# EAGLE board newPins-primitive (EAGLE 9.6.2), part 1 of 2
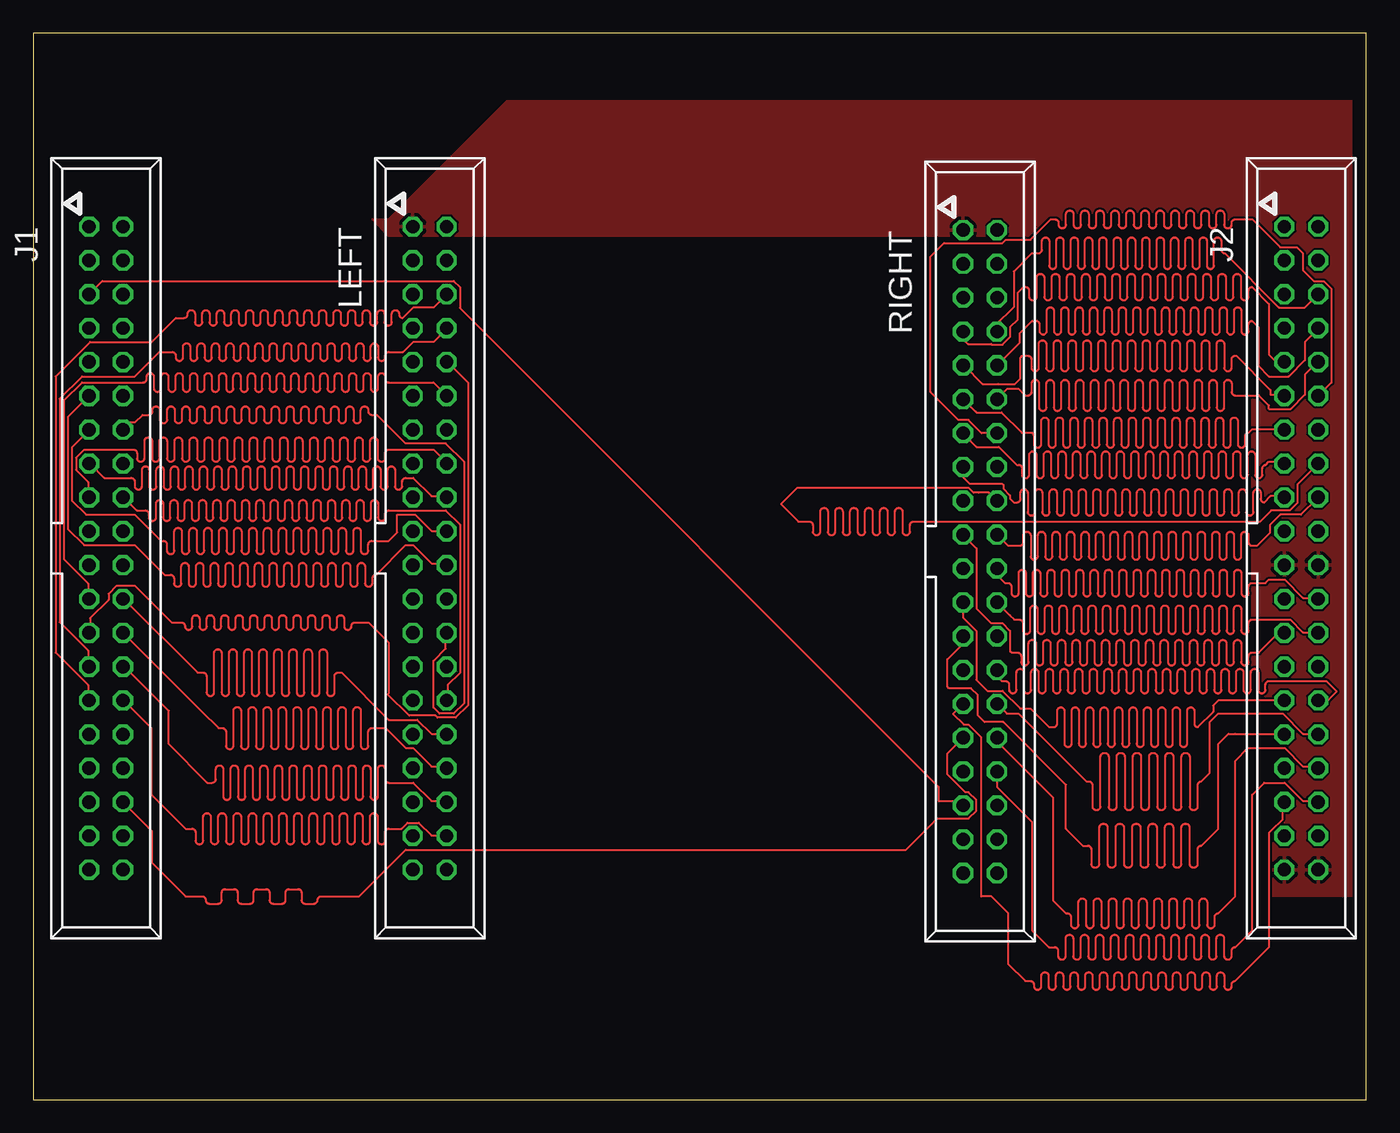
[diagram p1: board, top side]
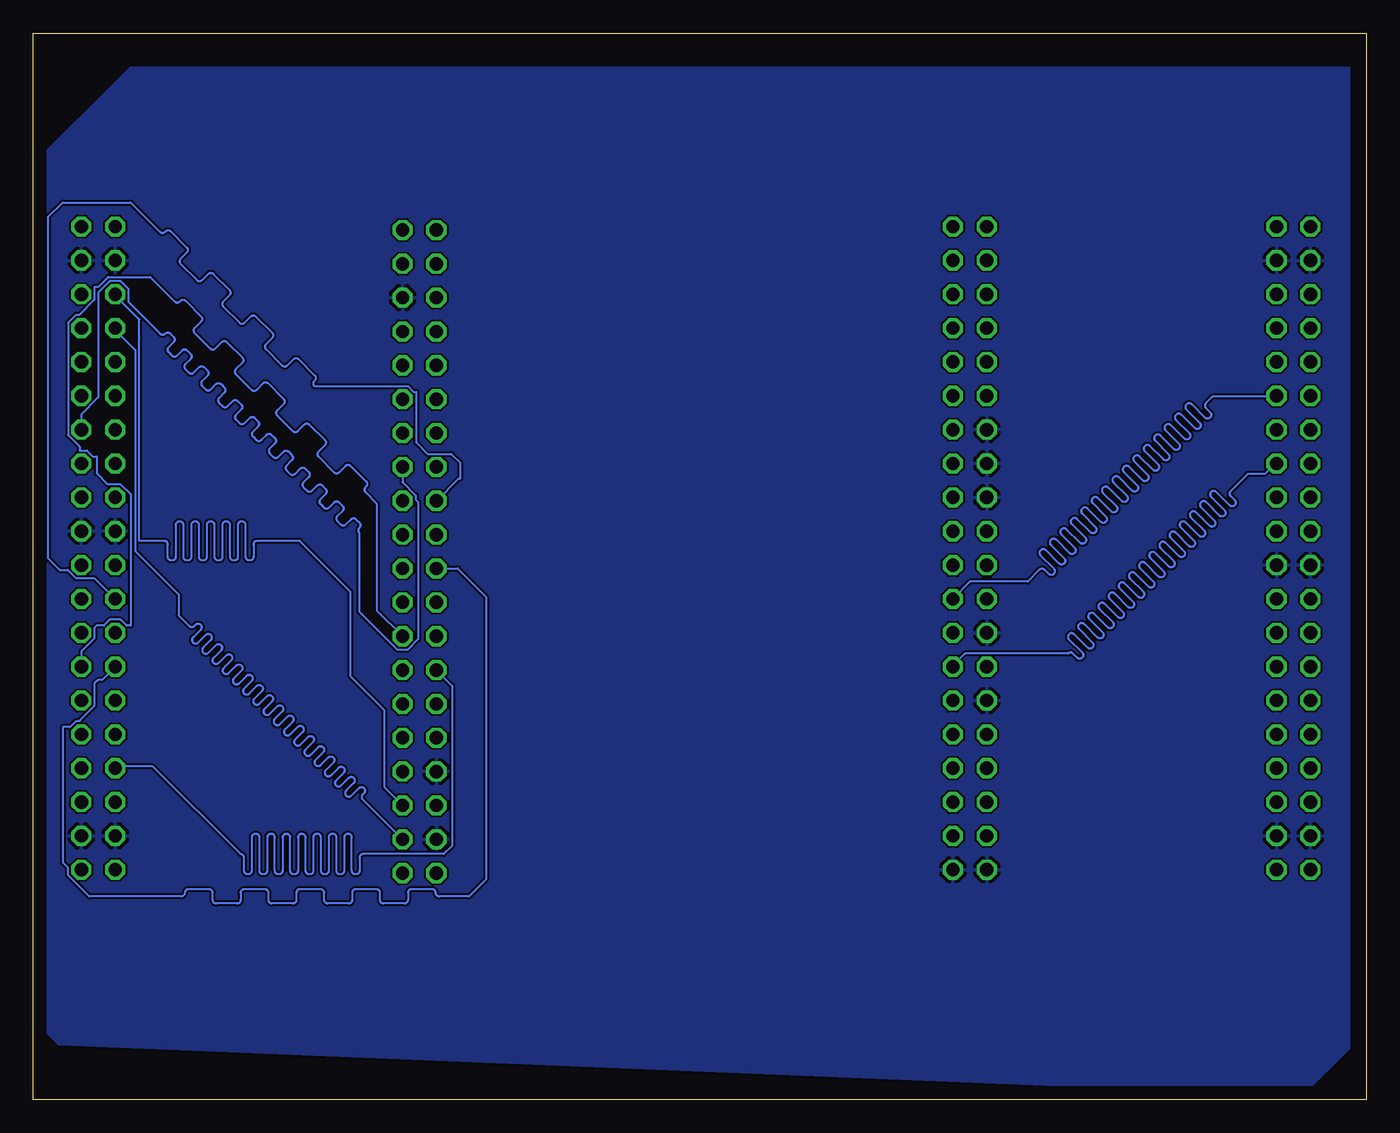
[diagram p2: board, bottom side, seen from below]

Size 100 x 80 mm. Coordinates in mm from the lower left corner, seen from the top.
Outline: 0,0 100,0 100,80 0,80 0,0
Copper layers (1*16): Top 0.035mm / dielectric 1.5mm / Bottom 0.035mm
Design rules "default *": minimum track width 6mil, minimum drill 0.35mm, track to track 6mil, track to pad 6mil, pad to pad 6mil, via to via 6mil, smd to smd 6mil, copper to edge 40mil, drill to drill 6mil, minimum pad ring 10mil, minimum via ring 8mil, stop-mask expansion 4mil, vias tented up to drill 0mil, thermal gap 10mil

## Footprints (pad centres in the part's own frame; a part is rotated, then mirrored left to right if it is on the bottom)
057-040-1 = drill 1 octagon: 1 -24.13,-1.27; 2 -24.13,1.27; 3 -21.59,-1.27; 4 -21.59,1.27; 5 -19.05,-1.27; 6 -19.05,1.27; 7 -16.51,-1.27; 8 -16.51,1.27; 9 -13.97,-1.27; 10 -13.97,1.27; 11 -11.43,-1.27; 12 -11.43,1.27; 13 -8.89,-1.27; 14 -8.89,1.27; 15 -6.35,-1.27; 16 -6.35,1.27; 17 -3.81,-1.27; 18 -3.81,1.27; 19 -1.27,-1.27; 20 -1.27,1.27; 21 1.27,-1.27; 22 1.27,1.27; 23 3.81,-1.27; 24 3.81,1.27; 25 6.35,-1.27; 26 6.35,1.27; 27 8.89,-1.27; 28 8.89,1.27; 29 11.43,-1.27; 30 11.43,1.27; 31 13.97,-1.27; 32 13.97,1.27; 33 16.51,-1.27; 34 16.51,1.27; 35 19.05,-1.27; 36 19.05,1.27; 37 21.59,-1.27; 38 21.59,1.27; 39 24.13,-1.27; 40 24.13,1.27

## Placement (x,y rotation side)
J1  057-040-1  [057-040-1]  5.45,41.37 270 top
J2  057-040-1  [057-040-1]  95.13,41.37 270 top
LEFT  057-040-1  [057-040-1]  29.74,41.37 270 top
RIGHT  057-040-1  [057-040-1]  71.03,41.12 270 top

## Tracks (layer width: path | path; a pad name or v marks a point on that pad's centre or on a via)
+3V3
  pour Top: 26.67,66.04 35.56,74.93 100.33,74.93 100.33,15.24 91.44,15.24 91.44,62.23 88.9,64.77 26.67,64.77 25.4,66.04
CTL_0
  Top 0.152: J1.36 8.81,20.24 8.89,20.15 8.89,17.78 11.43,15.24 12.67,15.24 arc-90 12.93,14.97 12.93,14.96 arc90 13.2,14.69 13.87,14.69 arc90 14.13,14.96 14.13,15.52 arc-90 14.4,15.79 15.06,15.79 arc-90 15.33,15.52 15.33,14.96 arc90 15.6,14.69 16.26,14.69 arc90 16.53,14.96 16.53,15.52 arc-90 16.8,15.79 17.46,15.79 arc-90 17.73,15.52 17.73,14.96 arc90 18,14.69 18.66,14.69 arc90 18.93,14.96 18.93,15.52 arc-90 19.19,15.79 19.86,15.79 arc-90 20.12,15.52 20.12,14.96 arc90 20.39,14.69 21.06,14.69 arc90 21.32,14.96 21.32,14.97 arc-90 21.59,15.24 24.43,15.24 27.94,18.75 65.48,18.75 67.82,21.08 70.17,21.08 70.74,21.66 70.74,22.47 70.17,23.05 69.93,23.05 68.58,24.39 68.58,25.96 RIGHT.31
CTL_1
  Top 0.152: J2.35 93.73,22.4 93.73,21.04 92.88,20.19 92.71,20.02 92.71,11.43 90.17,8.89 arc90 89.9,8.62 89.9,8.5 arc-90 89.64,8.23 89.62,8.23 arc-90 89.35,8.5 89.35,9.28 arc90 89.09,9.54 89.07,9.54 arc90 88.81,9.28 88.81,8.5 arc-90 88.54,8.23 88.52,8.23 arc-90 88.25,8.5 88.25,9.28 arc90 87.99,9.54 87.97,9.54 arc90 87.71,9.28 87.71,8.5 arc-90 87.44,8.23 87.42,8.23 arc-90 87.16,8.5 87.16,9.28 arc90 86.89,9.54 86.87,9.54 arc90 86.61,9.28 86.61,8.5 arc-90 86.34,8.23 86.33,8.23 arc-90 86.06,8.5 86.06,9.28 arc90 85.79,9.54 85.78,9.54 arc90 85.51,9.28 85.51,8.5 arc-90 85.24,8.23 85.23,8.23 arc-90 84.96,8.5 84.96,9.28 arc90 84.69,9.54 84.68,9.54 arc90 84.41,9.28 84.41,8.5 arc-90 84.14,8.23 84.13,8.23 arc-90 83.86,8.5 83.86,9.28 arc90 83.59,9.54 83.58,9.54 arc90 83.31,9.28 83.31,8.5 arc-90 83.05,8.23 83.03,8.23 arc-90 82.76,8.5 82.76,9.28 arc90 82.5,9.54 82.48,9.54 arc90 82.21,9.28 82.21,8.5 arc-90 81.95,8.23 81.93,8.23 arc-90 81.66,8.5 81.66,9.28 arc90 81.4,9.54 81.38,9.54 arc90 81.11,9.28 81.11,8.5 arc-90 80.85,8.23 80.83,8.23 arc-90 80.56,8.5 80.56,9.28 arc90 80.3,9.54 80.28,9.54 arc90 80.02,9.28 80.02,8.5 arc-90 79.75,8.23 79.73,8.23 arc-90 79.47,8.5 79.47,9.28 arc90 79.2,9.54 79.18,9.54 arc90 78.92,9.28 78.92,8.5 arc-90 78.65,8.23 78.64,8.23 arc-90 78.37,8.5 78.37,9.28 arc90 78.1,9.54 78.09,9.54 arc90 77.82,9.28 77.82,8.5 arc-90 77.55,8.23 77.54,8.23 arc-90 77.27,8.5 77.27,9.28 arc90 77,9.54 76.99,9.54 arc90 76.72,9.28 76.72,8.5 arc-90 76.45,8.23 76.44,8.23 arc-90 76.17,8.5 76.17,9.28 arc90 75.9,9.54 75.89,9.54 arc90 75.62,9.28 75.62,8.5 arc-90 75.36,8.23 75.34,8.23 arc-90 75.07,8.5 75.07,8.62 arc90 74.81,8.89 74.42,8.89 73.15,10.16 73.15,13.97 71.88,15.24 71.12,15.24 71.12,27.18 70.17,28.13 69.81,28.13 69.01,28.93 RIGHT.29
CTL_2
  Bottom 0.152: J2.33 93.73,24.99 91.03,24.99 84.45,18.41 arc90 84.19,18.15 84.19,17.16 arc-90 83.92,16.9 83.88,16.9 arc-90 83.61,17.16 83.61,19.66 arc90 83.34,19.93 83.3,19.93 arc90 83.03,19.66 83.03,17.16 arc-90 82.77,16.9 82.72,16.9 arc-90 82.45,17.16 82.45,19.66 arc90 82.19,19.93 82.14,19.93 arc90 81.88,19.66 81.88,17.16 arc-90 81.61,16.9 81.57,16.9 arc-90 81.3,17.16 81.3,19.66 arc90 81.03,19.93 80.99,19.93 arc90 80.72,19.66 80.72,17.16 arc-90 80.46,16.9 80.41,16.9 arc-90 80.14,17.16 80.14,19.66 arc90 79.88,19.93 79.83,19.93 arc90 79.57,19.66 79.57,17.16 arc-90 79.3,16.9 79.26,16.9 arc-90 78.99,17.16 78.99,19.66 arc90 78.72,19.93 78.68,19.93 arc90 78.41,19.66 78.41,17.16 arc-90 78.14,16.9 78.1,16.9 arc-90 77.83,17.16 77.83,19.66 arc90 77.57,19.93 77.52,19.93 arc90 77.26,19.66 77.26,17.16 arc-90 76.99,16.9 76.95,16.9 arc-90 76.68,17.16 76.68,19.66 arc90 76.41,19.93 76.37,19.93 arc90 76.1,19.66 76.1,17.16 arc-90 75.83,16.9 75.79,16.9 arc-90 75.52,17.16 75.52,18.15 arc90 75.26,18.41 69.22,18.41 68.58,19.05 68.58,31.05 RIGHT.27
CTL_3
  Top 0.152: J2.31 93.73,27.43 90.17,27.43 89.66,27.43 88.9,26.67 88.9,20.32 87.63,19.05 arc90 87.36,18.78 87.36,17.68 arc-90 87.1,17.41 87.02,17.41 arc-90 86.75,17.68 86.75,20.42 arc90 86.48,20.69 86.4,20.69 arc90 86.13,20.42 86.13,17.68 arc-90 85.87,17.41 85.78,17.41 arc-90 85.52,17.68 85.52,20.42 arc90 85.25,20.69 85.17,20.69 arc90 84.9,20.42 84.9,17.68 arc-90 84.64,17.41 84.56,17.41 arc-90 84.29,17.68 84.29,20.42 arc90 84.02,20.69 83.94,20.69 arc90 83.67,20.42 83.67,17.68 arc-90 83.41,17.41 83.32,17.41 arc-90 83.06,17.68 83.06,20.42 arc90 82.79,20.69 82.71,20.69 arc90 82.44,20.42 82.44,17.68 arc-90 82.18,17.41 82.09,17.41 arc-90 81.83,17.68 81.83,20.42 arc90 81.56,20.69 81.48,20.69 arc90 81.21,20.42 81.21,17.68 arc-90 80.95,17.41 80.86,17.41 arc-90 80.6,17.68 80.6,20.42 arc90 80.33,20.69 80.25,20.69 arc90 79.98,20.42 79.98,17.68 arc-90 79.72,17.41 79.63,17.41 arc-90 79.37,17.68 79.37,18.78 arc90 79.1,19.05 78.74,19.05 77.47,20.32 77.47,23.62 72.77,28.32 71.37,28.32 70.87,28.83 70.87,30.35 70.36,30.86 68.71,30.86 68.58,30.99 68.58,33.02 69.76,34.2 RIGHT.25
CTL_4
  Top 0.152: J2.29 88.9,29.94 88.52,29.56 88.52,29.08 87.38,27.94 arc-90 87.11,28.21 87.11,29.16 arc90 86.84,29.43 86.83,29.43 arc90 86.57,29.16 86.57,26.72 arc-90 86.3,26.45 86.29,26.45 arc-90 86.03,26.72 86.03,29.16 arc90 85.76,29.43 85.75,29.43 arc90 85.48,29.16 85.48,26.72 arc-90 85.22,26.45 85.21,26.45 arc-90 84.94,26.72 84.94,29.16 arc90 84.68,29.43 84.67,29.43 arc90 84.4,29.16 84.4,26.72 arc-90 84.13,26.45 84.13,26.45 arc-90 83.86,26.72 83.86,29.16 arc90 83.59,29.43 83.58,29.43 arc90 83.32,29.16 83.32,26.72 arc-90 83.05,26.45 83.04,26.45 arc-90 82.78,26.72 82.78,29.16 arc90 82.51,29.43 82.5,29.43 arc90 82.23,29.16 82.23,26.72 arc-90 81.97,26.45 81.96,26.45 arc-90 81.69,26.72 81.69,29.16 arc90 81.43,29.43 81.42,29.43 arc90 81.15,29.16 81.15,26.72 arc-90 80.88,26.45 80.88,26.45 arc-90 80.61,26.72 80.61,29.16 arc90 80.34,29.43 80.33,29.43 arc90 80.07,29.16 80.07,26.72 arc-90 79.8,26.45 79.79,26.45 arc-90 79.53,26.72 79.53,29.16 arc90 79.26,29.43 79.25,29.43 arc90 78.98,29.16 78.98,26.72 arc-90 78.72,26.45 78.71,26.45 arc-90 78.44,26.72 78.44,29.16 arc90 78.18,29.43 78.17,29.43 arc90 77.9,29.16 77.9,26.72 arc-90 77.64,26.45 77.63,26.45 arc-90 77.36,26.72 77.36,29.16 arc90 77.09,29.43 77.08,29.43 arc90 76.82,29.16 76.82,28.21 arc-90 76.55,27.94 76.2,27.94 74.8,29.34 74.04,29.34 72.71,30.67 71.57,30.67 70.74,31.49 70.74,35.17 69.76,36.16 RIGHT.23
CTL_5
  Bottom 0.152: J2.27 94.84,31.5 95.12,31.5 95.42,31.2 95.42,29.53 96.52,28.43 96.52,28.38 96.81,28.38 97.25,27.94 97.79,27.94 97.79,17.78 97.38,17.37 97.38,16.83 95.79,15.24 88.9,15.24 arc-90 88.63,15.51 88.63,15.51 arc90 88.37,15.78 86.81,15.78 arc90 86.54,15.51 86.54,14.97 arc-90 86.28,14.7 84.72,14.7 arc-90 84.45,14.97 84.45,15.51 arc90 84.18,15.78 82.62,15.78 arc90 82.36,15.51 82.36,14.97 arc-90 82.09,14.7 80.53,14.7 arc-90 80.27,14.97 80.27,15.51 arc90 80,15.78 78.44,15.78 arc90 78.17,15.51 78.17,14.97 arc-90 77.91,14.7 76.35,14.7 arc-90 76.08,14.97 76.08,15.51 arc90 75.81,15.78 74.26,15.78 arc90 73.99,15.51 73.99,14.97 arc-90 73.72,14.7 72.16,14.7 arc-90 71.9,14.97 71.9,15.51 arc90 71.63,15.78 70.07,15.78 arc90 69.81,15.51 69.81,15.51 arc-90 69.54,15.24 67.31,15.24 66.04,16.51 66.04,37.72 68.17,39.84 RIGHT.21
CTL_6
  Top 0.152: J2.25 93.52,35.1 91.95,33.53 91.44,33.53 arc90 91.17,33.26 91.17,32.84 arc-90 90.91,32.57 90.89,32.57 arc-90 90.62,32.84 90.62,34.22 arc90 90.36,34.48 90.34,34.48 arc90 90.07,34.22 90.07,32.84 arc-90 89.81,32.57 89.79,32.57 arc-90 89.52,32.84 89.52,34.22 arc90 89.26,34.48 89.24,34.48 arc90 88.97,34.22 88.97,32.84 arc-90 88.71,32.57 88.69,32.57 arc-90 88.42,32.84 88.42,34.22 arc90 88.16,34.48 88.14,34.48 arc90 87.87,34.22 87.87,32.84 arc-90 87.61,32.57 87.59,32.57 arc-90 87.32,32.84 87.32,34.22 arc90 87.06,34.48 87.04,34.48 arc90 86.77,34.22 86.77,32.84 arc-90 86.5,32.57 86.49,32.57 arc-90 86.22,32.84 86.22,34.22 arc90 85.95,34.48 85.94,34.48 arc90 85.67,34.22 85.67,32.84 arc-90 85.4,32.57 85.39,32.57 arc-90 85.12,32.84 85.12,34.22 arc90 84.85,34.48 84.84,34.48 arc90 84.57,34.22 84.57,32.84 arc-90 84.3,32.57 84.29,32.57 arc-90 84.02,32.84 84.02,34.22 arc90 83.75,34.48 83.74,34.48 arc90 83.47,34.22 83.47,32.84 arc-90 83.2,32.57 83.19,32.57 arc-90 82.92,32.84 82.92,34.22 arc90 82.65,34.48 82.64,34.48 arc90 82.37,34.22 82.37,32.84 arc-90 82.1,32.57 82.09,32.57 arc-90 81.82,32.84 81.82,34.22 arc90 81.55,34.48 81.54,34.48 arc90 81.27,34.22 81.27,32.84 arc-90 81,32.57 80.99,32.57 arc-90 80.72,32.84 80.72,34.22 arc90 80.45,34.48 80.44,34.48 arc90 80.17,34.22 80.17,32.84 arc-90 79.9,32.57 79.89,32.57 arc-90 79.62,32.84 79.62,34.22 arc90 79.35,34.48 79.33,34.48 arc90 79.07,34.22 79.07,32.84 arc-90 78.8,32.57 78.78,32.57 arc-90 78.52,32.84 78.52,34.22 arc90 78.25,34.48 78.23,34.48 arc90 77.97,34.22 77.97,32.84 arc-90 77.7,32.57 77.68,32.57 arc-90 77.42,32.84 77.42,34.22 arc90 77.15,34.48 77.13,34.48 arc90 76.87,34.22 76.87,32.84 arc-90 76.6,32.57 76.58,32.57 arc-90 76.32,32.84 76.32,34.22 arc90 76.05,34.48 76.03,34.48 arc90 75.77,34.22 75.77,32.84 arc-90 75.5,32.57 75.48,32.57 arc-90 75.22,32.84 75.22,34.22 arc90 74.95,34.48 74.93,34.48 arc90 74.67,34.22 74.67,32.84 arc-90 74.4,32.57 74.38,32.57 arc-90 74.12,32.84 74.12,33.26 arc90 73.85,33.53 73.41,33.53 73.28,33.65 73.28,35.17 72.71,35.75 71.85,35.75 70.76,36.83 70.76,41.35 69.85,42.27 69.85,42.3 RIGHT.19
CTL_7
  Bottom 0.152: J2.23 95.42,39.12 96.81,39.12 97.38,39.69 97.42,39.73 98,39.73 98.91,40.64 98.91,66.19 97.79,67.31 92.71,67.31 90.5,65.1 arc-90 90.12,65.1 90.08,65.14 arc90 89.7,65.14 88.48,63.92 arc90 88.48,63.55 88.95,63.08 arc-90 88.95,62.7 87.72,61.48 arc-90 87.35,61.48 86.88,61.95 arc90 86.5,61.95 85.28,60.73 arc90 85.28,60.35 85.75,59.88 arc-90 85.75,59.5 84.53,58.28 arc-90 84.15,58.28 83.68,58.75 arc90 83.3,58.75 82.08,57.53 arc90 82.08,57.15 82.55,56.68 arc-90 82.55,56.3 81.33,55.08 arc-90 80.95,55.08 80.48,55.55 arc90 80.1,55.55 78.88,54.33 arc90 78.88,53.95 78.93,53.91 arc-90 78.93,53.53 71.89,53.53 71.45,53.09 71.25,53.09 71.25,49.28 70.42,48.45 68.64,48.45 67.94,47.75 67.94,46.61 68.08,46.61 RIGHT.17
CTL_8
  Top 0.152: J2.17 93.73,45.26 92.81,45.26 92.35,44.81 arc-90 92.09,45.07 92.09,45.53 arc90 91.82,45.79 91.81,45.79 arc90 91.54,45.53 91.54,44.09 arc-90 91.28,43.82 91.26,43.82 arc-90 91,44.09 91,45.53 arc90 90.73,45.79 90.72,45.79 arc90 90.45,45.53 90.45,44.09 arc-90 90.18,43.82 90.17,43.82 arc-90 89.9,44.09 89.9,45.53 arc90 89.64,45.79 89.62,45.79 arc90 89.36,45.53 89.36,44.09 arc-90 89.09,43.82 89.08,43.82 arc-90 88.81,44.09 88.81,45.53 arc90 88.54,45.79 88.53,45.79 arc90 88.26,45.53 88.26,44.09 arc-90 88,43.82 87.98,43.82 arc-90 87.72,44.09 87.72,45.53 arc90 87.45,45.79 87.44,45.79 arc90 87.17,45.53 87.17,44.09 arc-90 86.91,43.82 86.89,43.82 arc-90 86.62,44.09 86.62,45.53 arc90 86.36,45.79 86.35,45.79 arc90 86.08,45.53 86.08,44.09 arc-90 85.81,43.82 85.8,43.82 arc-90 85.53,44.09 85.53,45.53 arc90 85.27,45.79 85.25,45.79 arc90 84.99,45.53 84.99,44.09 arc-90 84.72,43.82 84.71,43.82 arc-90 84.44,44.09 84.44,45.53 arc90 84.17,45.79 84.16,45.79 arc90 83.89,45.53 83.89,44.09 arc-90 83.63,43.82 83.61,43.82 arc-90 83.35,44.09 83.35,45.53 arc90 83.08,45.79 83.07,45.79 arc90 82.8,45.53 82.8,44.09 arc-90 82.53,43.82 82.52,43.82 arc-90 82.25,44.09 82.25,45.53 arc90 81.99,45.79 81.98,45.79 arc90 81.71,45.53 81.71,44.09 arc-90 81.44,43.82 81.43,43.82 arc-90 81.16,44.09 81.16,45.53 arc90 80.9,45.79 80.88,45.79 arc90 80.62,45.53 80.62,44.09 arc-90 80.35,43.82 80.34,43.82 arc-90 80.07,44.09 80.07,45.53 arc90 79.8,45.79 79.79,45.79 arc90 79.52,45.53 79.52,44.09 arc-90 79.26,43.82 79.25,43.82 arc-90 78.98,44.09 78.98,45.53 arc90 78.71,45.79 78.7,45.79 arc90 78.43,45.53 78.43,44.09 arc-90 78.17,43.82 78.15,43.82 arc-90 77.89,44.09 77.89,45.53 arc90 77.62,45.79 77.61,45.79 arc90 77.34,45.53 77.34,44.09 arc-90 77.07,43.82 77.06,43.82 arc-90 76.79,44.09 76.79,45.53 arc90 76.53,45.79 76.51,45.79 arc90 76.25,45.53 76.25,44.09 arc-90 75.98,43.82 75.97,43.82 arc-90 75.7,44.09 75.7,45.53 arc90 75.43,45.79 75.42,45.79 arc90 75.15,45.53 75.15,44.09 arc-90 74.89,43.82 74.88,43.82 arc-90 74.61,44.09 74.61,45.53 arc90 74.34,45.79 74.33,45.79 arc90 74.06,45.53 74.06,45.07 arc-90 73.8,44.81 73.56,44.81 73.28,45.08 73.28,45.33 72.78,45.83 72.78,46.12 72.69,46.22 70.25,46.22 69.38,47.09 RIGHT.15
CTL_9
  Top 0.152: J2.15 93.73,47.85 92.71,47.85 92.48,47.62 arc90 92.22,47.36 92.22,46.89 arc-90 91.95,46.62 91.94,46.62 arc-90 91.67,46.89 91.67,48.36 arc90 91.4,48.63 91.39,48.63 arc90 91.12,48.36 91.12,46.89 arc-90 90.86,46.62 90.84,46.62 arc-90 90.58,46.89 90.58,48.36 arc90 90.31,48.63 90.3,48.63 arc90 90.03,48.36 90.03,46.89 arc-90 89.76,46.62 89.75,46.62 arc-90 89.48,46.89 89.48,48.36 arc90 89.22,48.63 89.2,48.63 arc90 88.94,48.36 88.94,46.89 arc-90 88.67,46.62 88.66,46.62 arc-90 88.39,46.89 88.39,48.36 arc90 88.12,48.63 88.11,48.63 arc90 87.84,48.36 87.84,46.89 arc-90 87.57,46.62 87.56,46.62 arc-90 87.29,46.89 87.29,48.36 arc90 87.03,48.63 87.01,48.63 arc90 86.75,48.36 86.75,46.89 arc-90 86.48,46.62 86.47,46.62 arc-90 86.2,46.89 86.2,48.36 arc90 85.93,48.63 85.92,48.63 arc90 85.65,48.36 85.65,46.89 arc-90 85.39,46.62 85.37,46.62 arc-90 85.11,46.89 85.11,48.36 arc90 84.84,48.63 84.83,48.63 arc90 84.56,48.36 84.56,46.89 arc-90 84.29,46.62 84.28,46.62 arc-90 84.01,46.89 84.01,48.36 arc90 83.75,48.63 83.73,48.63 arc90 83.47,48.36 83.47,46.89 arc-90 83.2,46.62 83.19,46.62 arc-90 82.92,46.89 82.92,48.36 arc90 82.65,48.63 82.64,48.63 arc90 82.37,48.36 82.37,46.89 arc-90 82.11,46.62 82.09,46.62 arc-90 81.83,46.89 81.83,48.36 arc90 81.56,48.63 81.55,48.63 arc90 81.28,48.36 81.28,46.89 arc-90 81.01,46.62 81,46.62 arc-90 80.73,46.89 80.73,48.36 arc90 80.47,48.63 80.45,48.63 arc90 80.19,48.36 80.19,46.89 arc-90 79.92,46.62 79.91,46.62 arc-90 79.64,46.89 79.64,48.36 arc90 79.37,48.63 79.36,48.63 arc90 79.09,48.36 79.09,46.89 arc-90 78.83,46.62 78.81,46.62 arc-90 78.55,46.89 78.55,48.36 arc90 78.28,48.63 78.27,48.63 arc90 78,48.36 78,46.89 arc-90 77.73,46.62 77.72,46.62 arc-90 77.45,46.89 77.45,48.36 arc90 77.19,48.63 77.17,48.63 arc90 76.91,48.36 76.91,46.89 arc-90 76.64,46.62 76.63,46.62 arc-90 76.36,46.89 76.36,48.36 arc90 76.09,48.63 76.08,48.63 arc90 75.81,48.36 75.81,46.89 arc-90 75.55,46.62 75.53,46.62 arc-90 75.27,46.89 75.27,48.36 arc90 75,48.63 74.99,48.63 arc90 74.72,48.36 74.72,46.89 arc-90 74.45,46.62 74.44,46.62 arc-90 74.17,46.89 74.17,47.36 arc90 73.91,47.62 73.79,47.62 72.44,48.97 70.76,48.97 69.86,49.89 69.75,50 RIGHT.13
CTL_10
  Top 0.152: J2.13 93.73,50.29 91.44,50.29 91.19,50.04 arc90 90.92,49.77 90.92,49.18 arc-90 90.65,48.91 90.64,48.91 arc-90 90.37,49.18 90.37,50.9 arc90 90.11,51.17 90.09,51.17 arc90 89.83,50.9 89.83,49.18 arc-90 89.56,48.91 89.55,48.91 arc-90 89.28,49.18 89.28,50.9 arc90 89.01,51.17 89,51.17 arc90 88.73,50.9 88.73,49.18 arc-90 88.47,48.91 88.45,48.91 arc-90 88.19,49.18 88.19,50.9 arc90 87.92,51.17 87.91,51.17 arc90 87.64,50.9 87.64,49.18 arc-90 87.37,48.91 87.36,48.91 arc-90 87.09,49.18 87.09,50.9 arc90 86.83,51.17 86.81,51.17 arc90 86.55,50.9 86.55,49.18 arc-90 86.28,48.91 86.27,48.91 arc-90 86,49.18 86,50.9 arc90 85.73,51.17 85.72,51.17 arc90 85.45,50.9 85.45,49.18 arc-90 85.19,48.91 85.17,48.91 arc-90 84.91,49.18 84.91,50.9 arc90 84.64,51.17 84.63,51.17 arc90 84.36,50.9 84.36,49.18 arc-90 84.1,48.91 84.08,48.91 arc-90 83.82,49.18 83.82,50.9 arc90 83.55,51.17 83.54,51.17 arc90 83.27,50.9 83.27,49.18 arc-90 83,48.91 82.99,48.91 arc-90 82.72,49.18 82.72,50.9 arc90 82.46,51.17 82.44,51.17 arc90 82.18,50.9 82.18,49.18 arc-90 81.91,48.91 81.9,48.91 arc-90 81.63,49.18 81.63,50.9 arc90 81.36,51.17 81.35,51.17 arc90 81.08,50.9 81.08,49.18 arc-90 80.82,48.91 80.8,48.91 arc-90 80.54,49.18 80.54,50.9 arc90 80.27,51.17 80.26,51.17 arc90 79.99,50.9 79.99,49.18 arc-90 79.72,48.91 79.71,48.91 arc-90 79.44,49.18 79.44,50.9 arc90 79.18,51.17 79.17,51.17 arc90 78.9,50.9 78.9,49.18 arc-90 78.63,48.91 78.62,48.91 arc-90 78.35,49.18 78.35,50.9 arc90 78.08,51.17 78.07,51.17 arc90 77.81,50.9 77.81,49.18 arc-90 77.54,48.91 77.53,48.91 arc-90 77.26,49.18 77.26,50.9 arc90 76.99,51.17 76.98,51.17 arc90 76.71,50.9 76.71,49.18 arc-90 76.45,48.91 76.43,48.91 arc-90 76.17,49.18 76.17,50.9 arc90 75.9,51.17 75.89,51.17 arc90 75.62,50.9 75.62,49.18 arc-90 75.35,48.91 75.34,48.91 arc-90 75.07,49.18 75.07,49.77 arc90 74.81,50.04 74.17,50.04 72.64,51.56 70.76,51.56 70.69,51.63 69.84,52.47 69.77,52.55 RIGHT.11
CTL_11
  Top 0.152: J2.11 93.73,52.88 92.81,52.88 92.81,53.24 90.25,55.8 90.17,55.8 arc90 89.9,55.54 89.9,54.92 arc-90 89.64,54.65 89.61,54.65 arc-90 89.35,54.92 89.35,56.69 arc90 89.08,56.96 89.06,56.96 arc90 88.79,56.69 88.79,54.92 arc-90 88.52,54.65 88.5,54.65 arc-90 88.23,54.92 88.23,56.69 arc90 87.97,56.96 87.94,56.96 arc90 87.68,56.69 87.68,54.92 arc-90 87.41,54.65 87.39,54.65 arc-90 87.12,54.92 87.12,56.69 arc90 86.86,56.96 86.83,56.96 arc90 86.56,56.69 86.56,54.92 arc-90 86.3,54.65 86.28,54.65 arc-90 86.01,54.92 86.01,56.69 arc90 85.74,56.96 85.72,56.96 arc90 85.45,56.69 85.45,54.92 arc-90 85.19,54.65 85.16,54.65 arc-90 84.9,54.92 84.9,56.69 arc90 84.63,56.96 84.61,56.96 arc90 84.34,56.69 84.34,54.92 arc-90 84.07,54.65 84.05,54.65 arc-90 83.78,54.92 83.78,56.69 arc90 83.52,56.96 83.49,56.96 arc90 83.23,56.69 83.23,54.92 arc-90 82.96,54.65 82.94,54.65 arc-90 82.67,54.92 82.67,56.69 arc90 82.4,56.96 82.38,56.96 arc90 82.11,56.69 82.11,54.92 arc-90 81.85,54.65 81.83,54.65 arc-90 81.56,54.92 81.56,56.69 arc90 81.29,56.96 81.27,56.96 arc90 81,56.69 81,54.92 arc-90 80.73,54.65 80.71,54.65 arc-90 80.44,54.92 80.44,56.69 arc90 80.18,56.96 80.16,56.96 arc90 79.89,56.69 79.89,54.92 arc-90 79.62,54.65 79.6,54.65 arc-90 79.33,54.92 79.33,56.69 arc90 79.07,56.96 79.04,56.96 arc90 78.78,56.69 78.78,54.92 arc-90 78.51,54.65 78.49,54.65 arc-90 78.22,54.92 78.22,56.69 arc90 77.95,56.96 77.93,56.96 arc90 77.66,56.69 77.66,54.92 arc-90 77.4,54.65 77.37,54.65 arc-90 77.11,54.92 77.11,56.69 arc90 76.84,56.96 76.82,56.96 arc90 76.55,56.69 76.55,54.92 arc-90 76.28,54.65 76.26,54.65 arc-90 76,54.92 76,56.69 arc90 75.73,56.96 75.7,56.96 arc90 75.44,56.69 75.44,54.92 arc-90 75.17,54.65 75.15,54.65 arc-90 74.88,54.92 74.88,55.54 arc90 74.61,55.8 74.22,55.8 74.04,55.63 74.04,54.08 73.66,53.7 72.39,53.7 71.22,53.7 69.85,55.08 69.76,55.08 RIGHT.9
CTL_12
  Top 0.152: J2.9 93.73,55.47 93.12,55.47 92.71,55.88 92.71,59.69 91.44,60.96 arc90 91.17,60.69 91.17,60.24 arc-90 90.91,59.98 90.87,59.98 arc-90 90.61,60.24 90.61,61.68 arc90 90.34,61.94 90.31,61.94 arc90 90.04,61.68 90.04,60.24 arc-90 89.77,59.98 89.74,59.98 arc-90 89.47,60.24 89.47,61.68 arc90 89.2,61.94 89.17,61.94 arc90 88.9,61.68 88.9,60.24 arc-90 88.64,59.98 88.6,59.98 arc-90 88.33,60.24 88.33,61.68 arc90 88.07,61.94 88.03,61.94 arc90 87.77,61.68 87.77,60.24 arc-90 87.5,59.98 87.47,59.98 arc-90 87.2,60.24 87.2,61.68 arc90 86.93,61.94 86.9,61.94 arc90 86.63,61.68 86.63,60.24 arc-90 86.36,59.98 86.33,59.98 arc-90 86.06,60.24 86.06,61.68 arc90 85.8,61.94 85.76,61.94 arc90 85.5,61.68 85.5,60.24 arc-90 85.23,59.98 85.19,59.98 arc-90 84.93,60.24 84.93,61.68 arc90 84.66,61.94 84.63,61.94 arc90 84.36,61.68 84.36,60.24 arc-90 84.09,59.98 84.06,59.98 arc-90 83.79,60.24 83.79,61.68 arc90 83.53,61.94 83.49,61.94 arc90 83.22,61.68 83.22,60.24 arc-90 82.96,59.98 82.92,59.98 arc-90 82.66,60.24 82.66,61.68 arc90 82.39,61.94 82.36,61.94 arc90 82.09,61.68 82.09,60.24 arc-90 81.82,59.98 81.79,59.98 arc-90 81.52,60.24 81.52,61.68 arc90 81.26,61.94 81.22,61.94 arc90 80.95,61.68 80.95,60.24 arc-90 80.69,59.98 80.65,59.98 arc-90 80.39,60.24 80.39,61.68 arc90 80.12,61.94 80.09,61.94 arc90 79.82,61.68 79.82,60.24 arc-90 79.55,59.98 79.52,59.98 arc-90 79.25,60.24 79.25,61.68 arc90 78.98,61.94 78.95,61.94 arc90 78.68,61.68 78.68,60.24 arc-90 78.42,59.98 78.38,59.98 arc-90 78.12,60.24 78.12,61.68 arc90 77.85,61.94 77.81,61.94 arc90 77.55,61.68 77.55,60.24 arc-90 77.28,59.98 77.25,59.98 arc-90 76.98,60.24 76.98,61.68 arc90 76.71,61.94 76.68,61.94 arc90 76.41,61.68 76.41,60.24 arc-90 76.15,59.98 76.11,59.98 arc-90 75.84,60.24 75.84,61.68 arc90 75.58,61.94 75.54,61.94 arc90 75.28,61.68 75.28,60.24 arc-90 75.01,59.98 74.98,59.98 arc-90 74.71,60.24 74.71,60.69 arc90 74.44,60.96 74.3,60.96 73.86,60.53 73.86,58.53 73.28,57.95 73.28,57.22 72.71,56.64 71.89,56.64 71.85,56.68 70.12,56.68 69.75,57.05 69.21,57.6 69.19,57.62 RIGHT.7
CTL_PCLK
  Top 0.152: J1.5 4.27,60.5 5.18,61.42 31.55,61.42 32,60.96 32,59.38 67.92,23.47 67.92,22.4 68.58,22.4 69.42,22.4 RIGHT.35
DQBUS_0
  Bottom 0.152: J2.7 93.88,57.76 92.35,56.24 92.35,41.15 89.1,37.9 89.1,36.33 88.31,35.53 arc-90 87.93,35.53 87.83,35.63 arc90 87.45,35.63 87.45,35.62 arc90 87.45,35.24 88.02,34.67 arc-90 88.02,34.29 88.01,34.29 arc-90 87.64,34.29 87.06,34.86 arc90 86.69,34.86 86.68,34.85 arc90 86.68,34.48 87.25,33.91 arc-90 87.25,33.53 87.25,33.52 arc-90 86.87,33.52 86.3,34.09 arc90 85.92,34.09 85.91,34.09 arc90 85.91,33.71 86.49,33.14 arc-90 86.49,32.76 86.48,32.76 arc-90 86.1,32.76 85.53,33.33 arc90 85.15,33.33 85.15,33.32 arc90 85.15,32.95 85.72,32.37 arc-90 85.72,32 85.71,31.99 arc-90 85.34,31.99 84.76,32.56 arc90 84.39,32.56 84.38,32.56 arc90 84.38,32.18 84.95,31.61 arc-90 84.95,31.23 84.95,31.22 arc-90 84.57,31.22 84,31.8 arc90 83.62,31.8 83.61,31.79 arc90 83.61,31.41 84.19,30.84 arc-90 84.19,30.46 84.18,30.46 arc-90 83.8,30.46 83.23,31.03 arc90 82.85,31.03 82.85,31.02 arc90 82.85,30.65 83.42,30.07 arc-90 83.42,29.7 83.42,29.69 arc-90 83.04,29.69 82.47,30.26 arc90 82.09,30.26 82.08,30.26 arc90 82.08,29.88 82.66,29.31 arc-90 82.66,28.93 82.65,28.92 arc-90 82.27,28.92 81.7,29.5 arc90 81.32,29.5 81.32,29.49 arc90 81.32,29.11 81.89,28.54 arc-90 81.89,28.16 81.88,28.16 arc-90 81.5,28.16 80.93,28.73 arc90 80.56,28.73 80.55,28.72 arc90 80.55,28.35 81.12,27.77 arc-90 81.12,27.4 81.12,27.39 arc-90 80.74,27.39 80.17,27.96 arc90 79.79,27.96 79.78,27.96 arc90 79.78,27.58 80.36,27.01 arc-90 80.36,26.63 80.35,26.62 arc-90 79.97,26.62 79.4,27.2 arc90 79.02,27.2 79.02,27.19 arc90 79.02,26.81 79.59,26.24 arc-90 79.59,25.86 79.58,25.86 arc-90 79.21,25.86 78.63,26.43 arc90 78.26,26.43 78.25,26.43 arc90 78.25,26.05 78.82,25.48 arc-90 78.82,25.1 78.82,25.09 arc-90 78.44,25.09 77.87,25.66 arc90 77.49,25.66 77.48,25.66 arc90 77.48,25.28 78.06,24.71 arc-90 78.06,24.33 78.05,24.33 arc-90 77.67,24.33 77.1,24.9 arc90 76.72,24.9 76.72,24.89 arc90 76.72,24.52 77.29,23.94 arc-90 77.29,23.57 77.28,23.56 arc-90 76.91,23.56 76.33,24.13 arc90 75.96,24.13 75.95,24.13 arc90 75.95,23.75 76.52,23.18 arc-90 76.52,22.8 76.52,22.79 arc-90 76.14,22.79 75.57,23.37 arc90 75.19,23.37 75.19,23.36 arc90 75.19,22.98 75.28,22.89 arc-90 75.28,22.51 RIGHT.38
DQBUS_1
  Bottom 0.152: J2.5 93.88,60.35 92.05,58.52 92.05,57.15 92.05,41.91 90.17,41.91 arc90 89.9,41.64 89.9,40.71 arc-90 89.64,40.45 89.59,40.45 arc-90 89.32,40.71 89.32,43.11 arc90 89.05,43.38 89,43.38 arc90 88.74,43.11 88.74,40.71 arc-90 88.47,40.45 88.42,40.45 arc-90 88.15,40.71 88.15,43.11 arc90 87.89,43.38 87.84,43.38 arc90 87.57,43.11 87.57,40.71 arc-90 87.3,40.45 87.25,40.45 arc-90 86.99,40.71 86.99,43.11 arc90 86.72,43.38 86.67,43.38 arc90 86.4,43.11 86.4,40.71 arc-90 86.14,40.45 86.09,40.45 arc-90 85.82,40.71 85.82,43.11 arc90 85.55,43.38 85.5,43.38 arc90 85.24,43.11 85.24,40.71 arc-90 84.97,40.45 84.92,40.45 arc-90 84.65,40.71 84.65,43.11 arc90 84.39,43.38 84.33,43.38 arc90 84.07,43.11 84.07,40.71 arc-90 83.8,40.45 83.75,40.45 arc-90 83.48,40.71 83.48,41.64 arc90 83.22,41.91 80.01,41.91 76.2,38.1 76.2,31.75 73.66,29.21 73.66,23.43 RIGHT.36
DQBUS_2
  Top 0.152: J2.36 96.32,22.4 95.25,22.4 93.88,23.77 92.35,23.77 91.44,22.86 91.44,12.7 90.17,11.43 arc90 89.9,11.16 89.9,10.77 arc-90 89.64,10.5 89.6,10.5 arc-90 89.34,10.77 89.34,12.09 arc90 89.07,12.36 89.04,12.36 arc90 88.77,12.09 88.77,10.77 arc-90 88.5,10.5 88.47,10.5 arc-90 88.21,10.77 88.21,12.09 arc90 87.94,12.36 87.91,12.36 arc90 87.64,12.09 87.64,10.77 arc-90 87.37,10.5 87.34,10.5 arc-90 87.07,10.77 87.07,12.09 arc90 86.81,12.36 86.77,12.36 arc90 86.51,12.09 86.51,10.77 arc-90 86.24,10.5 86.21,10.5 arc-90 85.94,10.77 85.94,12.09 arc90 85.67,12.36 85.64,12.36 arc90 85.38,12.09 85.38,10.77 arc-90 85.11,10.5 85.08,10.5 arc-90 84.81,10.77 84.81,12.09 arc90 84.54,12.36 84.51,12.36 arc90 84.24,12.09 84.24,10.77 arc-90 83.98,10.5 83.94,10.5 arc-90 83.68,10.77 83.68,12.09 arc90 83.41,12.36 83.38,12.36 arc90 83.11,12.09 83.11,10.77 arc-90 82.84,10.5 82.81,10.5 arc-90 82.55,10.77 82.55,12.09 arc90 82.28,12.36 82.25,12.36 arc90 81.98,12.09 81.98,10.77 arc-90 81.71,10.5 81.68,10.5 arc-90 81.41,10.77 81.41,12.09 arc90 81.15,12.36 81.11,12.36 arc90 80.85,12.09 80.85,10.77 arc-90 80.58,10.5 80.55,10.5 arc-90 80.28,10.77 80.28,12.09 arc90 80.02,12.36 79.98,12.36 arc90 79.72,12.09 79.72,10.77 arc-90 79.45,10.5 79.42,10.5 arc-90 79.15,10.77 79.15,12.09 arc90 78.88,12.36 78.85,12.36 arc90 78.58,12.09 78.58,10.77 arc-90 78.32,10.5 78.28,10.5 arc-90 78.02,10.77 78.02,12.09 arc90 77.75,12.36 77.72,12.36 arc90 77.45,12.09 77.45,10.77 arc-90 77.19,10.5 77.15,10.5 arc-90 76.89,10.77 76.89,11.16 arc90 76.62,11.43 76.2,11.43 74.93,12.7 74.93,20.82 72.3,23.45 RIGHT.34
DQBUS_3
  Top 0.152: J2.34 96.32,24.99 95.25,24.99 93.88,26.36 91.14,26.36 90.17,25.4 90.17,19.05 90.17,15.24 88.9,13.97 arc90 88.63,13.7 88.63,13.12 arc-90 88.37,12.86 88.33,12.86 arc-90 88.07,13.12 88.07,14.82 arc90 87.8,15.08 87.77,15.08 arc90 87.5,14.82 87.5,13.12 arc-90 87.23,12.86 87.2,12.86 arc-90 86.93,13.12 86.93,14.82 arc90 86.66,15.08 86.63,15.08 arc90 86.36,14.82 86.36,13.12 arc-90 86.1,12.86 86.06,12.86 arc-90 85.8,13.12 85.8,14.82 arc90 85.53,15.08 85.5,15.08 arc90 85.23,14.82 85.23,13.12 arc-90 84.96,12.86 84.93,12.86 arc-90 84.66,13.12 84.66,14.82 arc90 84.39,15.08 84.36,15.08 arc90 84.09,14.82 84.09,13.12 arc-90 83.83,12.86 83.79,12.86 arc-90 83.53,13.12 83.53,14.82 arc90 83.26,15.08 83.22,15.08 arc90 82.96,14.82 82.96,13.12 arc-90 82.69,12.86 82.66,12.86 arc-90 82.39,13.12 82.39,14.82 arc90 82.12,15.08 82.09,15.08 arc90 81.82,14.82 81.82,13.12 arc-90 81.56,12.86 81.52,12.86 arc-90 81.26,13.12 81.26,14.82 arc90 80.99,15.08 80.96,15.08 arc90 80.69,14.82 80.69,13.12 arc-90 80.42,12.86 80.39,12.86 arc-90 80.12,13.12 80.12,14.82 arc90 79.86,15.08 79.82,15.08 arc90 79.55,14.82 79.55,13.12 arc-90 79.29,12.86 79.25,12.86 arc-90 78.99,13.12 78.99,14.82 arc90 78.72,15.08 78.69,15.08 arc90 78.42,14.82 78.42,13.12 arc-90 78.15,12.86 78.12,12.86 arc-90 77.85,13.12 77.85,13.7 arc90 77.58,13.97 77.47,13.97 76.5,14.94 76.5,17.48 76.5,22.66 72.16,27 RIGHT.32
DQBUS_4
  Top 0.152: J2.32 96.32,27.43 95.25,27.43 93.73,28.96 88.9,28.96 88.27,28.32 88.27,24.5 87.63,23.86 arc90 87.36,23.6 87.36,21.99 arc-90 87.1,21.73 87.02,21.73 arc-90 86.75,21.99 86.75,25.73 arc90 86.49,26 86.41,26 arc90 86.15,25.73 86.15,21.99 arc-90 85.88,21.73 85.81,21.73 arc-90 85.54,21.99 85.54,25.73 arc90 85.27,26 85.2,26 arc90 84.93,25.73 84.93,21.99 arc-90 84.67,21.73 84.59,21.73 arc-90 84.32,21.99 84.32,25.73 arc90 84.06,26 83.98,26 arc90 83.72,25.73 83.72,21.99 arc-90 83.45,21.73 83.37,21.73 arc-90 83.11,21.99 83.11,25.73 arc90 82.84,26 82.77,26 arc90 82.5,25.73 82.5,21.99 arc-90 82.23,21.73 82.16,21.73 arc-90 81.89,21.99 81.89,25.73 arc90 81.62,26 81.55,26 arc90 81.28,25.73 81.28,21.99 arc-90 81.02,21.73 80.94,21.73 arc-90 80.67,21.99 80.67,25.73 arc90 80.41,26 80.33,26 arc90 80.07,25.73 80.07,21.99 arc-90 79.8,21.73 79.73,21.73 arc-90 79.46,21.99 79.46,23.6 arc90 79.19,23.86 79.01,23.86 73.91,28.96 73.03,28.96 RIGHT.30
DQBUS_5
  Top 0.152: RIGHT.28 72.3,31.75 72.66,31.39 72.94,31.39 arc-90 73.21,31.13 73.21,30.75 arc90 73.48,30.48 73.5,30.48 arc90 73.76,30.75 73.76,32.04 arc-90 74.03,32.31 74.04,32.31 arc-90 74.31,32.04 74.31,30.75 arc90 74.58,30.48 74.59,30.48 arc90 74.86,30.75 74.86,32.04 arc-90 75.13,32.31 75.14,32.31 arc-90 75.41,32.04 75.41,30.75 arc90 75.68,30.48 75.69,30.48 arc90 75.96,30.75 75.96,32.04 arc-90 76.23,32.31 76.24,32.31 arc-90 76.51,32.04 76.51,30.75 arc90 76.78,30.48 76.79,30.48 arc90 77.06,30.75 77.06,32.04 arc-90 77.33,32.31 77.34,32.31 arc-90 77.61,32.04 77.61,30.75 arc90 77.87,30.48 77.89,30.48 arc90 78.16,30.75 78.16,32.04 arc-90 78.42,32.31 78.44,32.31 arc-90 78.71,32.04 78.71,30.75 arc90 78.97,30.48 78.99,30.48 arc90 79.26,30.75 79.26,32.04 arc-90 79.52,32.31 79.54,32.31 arc-90 79.81,32.04 79.81,30.75 arc90 80.07,30.48 80.09,30.48 arc90 80.36,30.75 80.36,32.04 arc-90 80.62,32.31 80.64,32.31 arc-90 80.91,32.04 80.91,30.75 arc90 81.17,30.48 81.19,30.48 arc90 81.45,30.75 81.45,32.04 arc-90 81.72,32.31 81.74,32.31 arc-90 82,32.04 82,30.75 arc90 82.27,30.48 82.29,30.48 arc90 82.55,30.75 82.55,32.04 arc-90 82.82,32.31 82.84,32.31 arc-90 83.1,32.04 83.1,30.75 arc90 83.37,30.48 83.39,30.48 arc90 83.65,30.75 83.65,32.04 arc-90 83.92,32.31 83.94,32.31 arc-90 84.2,32.04 84.2,30.75 arc90 84.47,30.48 84.48,30.48 arc90 84.75,30.75 84.75,32.04 arc-90 85.02,32.31 85.03,32.31 arc-90 85.3,32.04 85.3,30.75 arc90 85.57,30.48 85.58,30.48 arc90 85.85,30.75 85.85,32.04 arc-90 86.12,32.31 86.13,32.31 arc-90 86.4,32.04 86.4,30.75 arc90 86.67,30.48 86.68,30.48 arc90 86.95,30.75 86.95,32.04 arc-90 87.22,32.31 87.23,32.31 arc-90 87.5,32.04 87.5,30.75 arc90 87.77,30.48 87.78,30.48 arc90 88.05,30.75 88.05,32.04 arc-90 88.31,32.31 88.33,32.31 arc-90 88.6,32.04 88.6,30.75 arc90 88.86,30.48 88.88,30.48 arc90 89.15,30.75 89.15,32.04 arc-90 89.41,32.31 89.43,32.31 arc-90 89.7,32.04 89.7,30.75 arc90 89.96,30.48 89.98,30.48 arc90 90.25,30.75 90.25,32.04 arc-90 90.51,32.31 90.53,32.31 arc-90 90.8,32.04 90.8,30.75 arc90 91.06,30.48 91.08,30.48 arc90 91.34,30.75 91.34,32.04 arc-90 91.61,32.31 91.63,32.31 arc-90 91.89,32.04 91.89,30.75 arc90 92.16,30.48 92.18,30.48 arc90 92.44,30.75 92.44,31.13 arc-90 92.71,31.39 97,31.39 97.79,30.61 97.12,29.94 J2.30
DQBUS_6
  Bottom 0.152: J2.28 96.4,33.63 95.42,34.61 95.42,35.39 95.25,35.56 94.71,35.56 94.27,36 93.45,36 93.01,35.56 92.71,35.56 92.71,45.42 93.45,46.16 94.42,46.16 95.25,46.99 95.25,48.26 95.55,48.26 95.99,48.7 96.52,48.7 96.52,48.99 97.38,49.85 97.38,58.29 96.81,58.86 96.57,58.86 95.42,60.01 95.42,60.96 95.14,60.96 94.39,61.71 91.22,61.71 89.39,59.87 arc-90 89.01,59.87 88.95,59.93 arc90 88.58,59.93 87.41,58.76 arc90 87.41,58.38 87.9,57.89 arc-90 87.9,57.52 86.73,56.34 arc-90 86.35,56.34 85.86,56.83 arc90 85.48,56.83 84.31,55.66 arc90 84.31,55.29 84.8,54.8 arc-90 84.8,54.42 83.63,53.25 arc-90 83.25,53.25 82.76,53.74 arc90 82.39,53.74 81.22,52.57 arc90 81.22,52.19 81.71,51.7 arc-90 81.71,51.32 80.54,50.15 arc-90 80.16,50.15 79.67,50.64 arc90 79.29,50.64 78.12,49.47 arc90 78.12,49.1 78.61,48.61 arc-90 78.61,48.23 77.44,47.06 arc-90 77.06,47.06 76.57,47.55 arc90 76.2,47.55 75.03,46.38 arc90 75.03,46 75.08,45.95 arc-90 75.08,45.57 74.23,44.71 74.23,36.69 RIGHT.26
DQBUS_7
  Top 0.152: J2.26 96.32,35.05 95.25,35.05 94.3,36 91.44,36 arc90 91.17,35.73 91.17,35.2 arc-90 90.91,34.94 90.89,34.94 arc-90 90.63,35.2 90.63,36.8 arc90 90.36,37.07 90.35,37.07 arc90 90.08,36.8 90.08,35.2 arc-90 89.81,34.94 89.8,34.94 arc-90 89.54,35.2 89.54,36.8 arc90 89.27,37.07 89.26,37.07 arc90 88.99,36.8 88.99,35.2 arc-90 88.72,34.94 88.71,34.94 arc-90 88.44,35.2 88.44,36.8 arc90 88.18,37.07 88.17,37.07 arc90 87.9,36.8 87.9,35.2 arc-90 87.63,34.94 87.62,34.94 arc-90 87.35,35.2 87.35,36.8 arc90 87.08,37.07 87.07,37.07 arc90 86.81,36.8 86.81,35.2 arc-90 86.54,34.94 86.53,34.94 arc-90 86.26,35.2 86.26,36.8 arc90 85.99,37.07 85.98,37.07 arc90 85.71,36.8 85.71,35.2 arc-90 85.45,34.94 85.44,34.94 arc-90 85.17,35.2 85.17,36.8 arc90 84.9,37.07 84.89,37.07 arc90 84.62,36.8 84.62,35.2 arc-90 84.36,34.94 84.34,34.94 arc-90 84.08,35.2 84.08,36.8 arc90 83.81,37.07 83.8,37.07 arc90 83.53,36.8 83.53,35.2 arc-90 83.26,34.94 83.25,34.94 arc-90 82.98,35.2 82.98,36.8 arc90 82.72,37.07 82.71,37.07 arc90 82.44,36.8 82.44,35.2 arc-90 82.17,34.94 82.16,34.94 arc-90 81.89,35.2 81.89,36.8 arc90 81.63,37.07 81.61,37.07 arc90 81.35,36.8 81.35,35.2 arc-90 81.08,34.94 81.07,34.94 arc-90 80.8,35.2 80.8,36.8 arc90 80.53,37.07 80.52,37.07 arc90 80.25,36.8 80.25,35.2 arc-90 79.99,34.94 79.98,34.94 arc-90 79.71,35.2 79.71,36.8 arc90 79.44,37.07 79.43,37.07 arc90 79.16,36.8 79.16,35.2 arc-90 78.9,34.94 78.88,34.94 arc-90 78.62,35.2 78.62,36.8 arc90 78.35,37.07 78.34,37.07 arc90 78.07,36.8 78.07,35.2 arc-90 77.81,34.94 77.79,34.94 arc-90 77.53,35.2 77.53,36.8 arc90 77.26,37.07 77.25,37.07 arc90 76.98,36.8 76.98,35.2 arc-90 76.71,34.94 76.7,34.94 arc-90 76.43,35.2 76.43,36.8 arc90 76.17,37.07 76.16,37.07 arc90 75.89,36.8 75.89,35.2 arc-90 75.62,34.94 75.61,34.94 arc-90 75.34,35.2 75.34,36.8 arc90 75.08,37.07 75.06,37.07 arc90 74.8,36.8 74.8,35.2 arc-90 74.53,34.94 74.52,34.94 arc-90 74.25,35.2 74.25,35.73 arc90 73.98,36 73.6,36 73.28,36.32 73.28,36.33 RIGHT.24
DQBUS_8
  Top 0.152: J2.24 96.32,37.64 95.25,37.64 93.88,39.01 92.71,39.01 92.44,38.75 91.44,38.75 arc90 91.17,38.48 91.17,38.01 arc-90 90.91,37.75 90.9,37.75 arc-90 90.63,38.01 90.63,39.48 arc90 90.37,39.75 90.36,39.75 arc90 90.09,39.48 90.09,38.01 arc-90 89.83,37.75 89.82,37.75 arc-90 89.56,38.01 89.56,39.48 arc90 89.29,39.75 89.28,39.75 arc90 89.02,39.48 89.02,38.01 arc-90 88.75,37.75 88.75,37.75 arc-90 88.48,38.01 88.48,39.48 arc90 88.21,39.75 88.21,39.75 arc90 87.94,39.48 87.94,38.01 arc-90 87.67,37.75 87.67,37.75 arc-90 87.4,38.01 87.4,39.48 arc90 87.13,39.75 87.13,39.75 arc90 86.86,39.48 86.86,38.01 arc-90 86.59,37.75 86.59,37.75 arc-90 86.32,38.01 86.32,39.48 arc90 86.06,39.75 86.05,39.75 arc90 85.78,39.48 85.78,38.01 arc-90 85.52,37.75 85.51,37.75 arc-90 85.25,38.01 85.25,39.48 arc90 84.98,39.75 84.97,39.75 arc90 84.71,39.48 84.71,38.01 arc-90 84.44,37.75 84.43,37.75 arc-90 84.17,38.01 84.17,39.48 arc90 83.9,39.75 83.89,39.75 arc90 83.63,39.48 83.63,38.01 arc-90 83.36,37.75 83.36,37.75 arc-90 83.09,38.01 83.09,39.48 arc90 82.82,39.75 82.82,39.75 arc90 82.55,39.48 82.55,38.01 arc-90 82.28,37.75 82.28,37.75 arc-90 82.01,38.01 82.01,39.48 arc90 81.75,39.75 81.74,39.75 arc90 81.47,39.48 81.47,38.01 arc-90 81.21,37.75 81.2,37.75 arc-90 80.93,38.01 80.93,39.48 arc90 80.67,39.75 80.66,39.75 arc90 80.39,39.48 80.39,38.01 arc-90 80.13,37.75 80.12,37.75 arc-90 79.86,38.01 79.86,39.48 arc90 79.59,39.75 79.58,39.75 arc90 79.32,39.48 79.32,38.01 arc-90 79.05,37.75 79.05,37.75 arc-90 78.78,38.01 78.78,39.48 arc90 78.51,39.75 78.51,39.75 arc90 78.24,39.48 78.24,38.01 arc-90 77.97,37.75 77.97,37.75 arc-90 77.7,38.01 77.7,39.48 arc90 77.43,39.75 77.43,39.75 arc90 77.16,39.48 77.16,38.01 arc-90 76.89,37.75 76.89,37.75 arc-90 76.62,38.01 76.62,39.48 arc90 76.36,39.75 76.35,39.75 arc90 76.08,39.48 76.08,38.01 arc-90 75.82,37.75 75.81,37.75 arc-90 75.55,38.01 75.55,39.48 arc90 75.28,39.75 75.27,39.75 arc90 75.01,39.48 75.01,38.01 arc-90 74.74,37.75 74.73,37.75 arc-90 74.47,38.01 74.47,39.48 arc90 74.2,39.75 74.19,39.75 arc90 73.93,39.48 73.93,38.01 arc-90 73.66,37.75 73.66,37.75 arc-90 73.39,38.01 73.39,38.48 arc90 73.12,38.75 72.9,38.75 72.33,39.31 72.3,39.35 RIGHT.22
DQBUS_9
  Top 0.152: J2.18 96.32,45.11 95.1,43.89 93.57,43.89 92.79,43.1 92.79,42.52 91.82,41.55 91.44,41.55 arc-90 91.17,41.82 91.17,42.33 arc90 90.91,42.6 90.89,42.6 arc90 90.63,42.33 90.63,40.77 arc-90 90.36,40.51 90.35,40.51 arc-90 90.08,40.77 90.08,42.33 arc90 89.82,42.6 89.81,42.6 arc90 89.54,42.33 89.54,40.77 arc-90 89.27,40.51 89.26,40.51 arc-90 88.99,40.77 88.99,42.33 arc90 88.73,42.6 88.72,42.6 arc90 88.45,42.33 88.45,40.77 arc-90 88.18,40.51 88.17,40.51 arc-90 87.9,40.77 87.9,42.33 arc90 87.64,42.6 87.63,42.6 arc90 87.36,42.33 87.36,40.77 arc-90 87.09,40.51 87.08,40.51 arc-90 86.81,40.77 86.81,42.33 arc90 86.55,42.6 86.54,42.6 arc90 86.27,42.33 86.27,40.77 arc-90 86,40.51 85.99,40.51 arc-90 85.72,40.77 85.72,42.33 arc90 85.46,42.6 85.45,42.6 arc90 85.18,42.33 85.18,40.77 arc-90 84.91,40.51 84.9,40.51 arc-90 84.64,40.77 84.64,42.33 arc90 84.37,42.6 84.36,42.6 arc90 84.09,42.33 84.09,40.77 arc-90 83.82,40.51 83.81,40.51 arc-90 83.55,40.77 83.55,42.33 arc90 83.28,42.6 83.27,42.6 arc90 83,42.33 83,40.77 arc-90 82.73,40.51 82.72,40.51 arc-90 82.45,40.77 82.45,42.33 arc90 82.19,42.6 82.18,42.6 arc90 81.91,42.33 81.91,40.77 arc-90 81.64,40.51 81.63,40.51 arc-90 81.36,40.77 81.36,42.33 arc90 81.1,42.6 81.09,42.6 arc90 80.82,42.33 80.82,40.77 arc-90 80.55,40.51 80.54,40.51 arc-90 80.28,40.77 80.28,42.33 arc90 80.01,42.6 80,42.6 arc90 79.73,42.33 79.73,40.77 arc-90 79.46,40.51 79.45,40.51 arc-90 79.19,40.77 79.19,42.33 arc90 78.92,42.6 78.91,42.6 arc90 78.64,42.33 78.64,40.77 arc-90 78.37,40.51 78.36,40.51 arc-90 78.1,40.77 78.1,42.33 arc90 77.83,42.6 77.82,42.6 arc90 77.55,42.33 77.55,40.77 arc-90 77.28,40.51 77.27,40.51 arc-90 77.01,40.77 77.01,42.33 arc90 76.74,42.6 76.73,42.6 arc90 76.46,42.33 76.46,40.77 arc-90 76.19,40.51 76.18,40.51 arc-90 75.92,40.77 75.92,42.33 arc90 75.65,42.6 75.64,42.6 arc90 75.37,42.33 75.37,40.77 arc-90 75.11,40.51 75.09,40.51 arc-90 74.83,40.77 74.83,42.33 arc90 74.56,42.6 74.55,42.6 arc90 74.28,42.33 74.28,41.82 arc-90 74.02,41.55 73.13,41.55 72.58,42.1 RIGHT.20
DQBUS_10
  Top 0.152: J2.16 94.84,46.16 94.84,44.77 94.27,44.2 92.88,44.2 92.05,43.37 66.04,43.37 arc90 65.77,43.1 65.77,42.62 arc-90 65.51,42.35 65.48,42.35 arc-90 65.21,42.62 65.21,44.12 arc90 64.95,44.39 64.92,44.39 arc90 64.65,44.12 64.65,42.62 arc-90 64.39,42.35 64.36,42.35 arc-90 64.09,42.62 64.09,44.12 arc90 63.82,44.39 63.8,44.39 arc90 63.53,44.12 63.53,42.62 arc-90 63.26,42.35 63.24,42.35 arc-90 62.97,42.62 62.97,44.12 arc90 62.7,44.39 62.67,44.39 arc90 62.41,44.12 62.41,42.62 arc-90 62.14,42.35 62.11,42.35 arc-90 61.85,42.62 61.85,44.12 arc90 61.58,44.39 61.55,44.39 arc90 61.29,44.12 61.29,42.62 arc-90 61.02,42.35 60.99,42.35 arc-90 60.73,42.62 60.73,44.12 arc90 60.46,44.39 60.43,44.39 arc90 60.16,44.12 60.16,42.62 arc-90 59.9,42.35 59.87,42.35 arc-90 59.6,42.62 59.6,44.12 arc90 59.34,44.39 59.31,44.39 arc90 59.04,44.12 59.04,42.62 arc-90 58.78,42.35 58.75,42.35 arc-90 58.48,42.62 58.48,43.1 arc90 58.22,43.37 57.4,43.37 56.1,44.67 57.34,45.91 70.17,45.91 70.54,45.53 70.93,45.53 71.69,45.53 RIGHT.18
DQBUS_11
  Bottom 0.152: J2.14 96.4,51.41 95.11,52.7 95.11,60.56 94.27,61.4 93.45,61.4 92.88,60.83 92.88,59.86 90.48,57.47 arc-90 90.11,57.47 90.1,57.47 arc90 89.72,57.47 89.47,57.22 arc90 89.47,56.84 89.86,56.45 arc-90 89.86,56.07 89.6,55.81 arc-90 89.22,55.81 88.83,56.2 arc90 88.46,56.2 88.2,55.95 arc90 88.2,55.57 88.59,55.18 arc-90 88.59,54.8 88.33,54.55 arc-90 87.96,54.55 87.57,54.94 arc90 87.19,54.94 86.93,54.68 arc90 86.93,54.3 87.33,53.91 arc-90 87.33,53.54 87.07,53.28 arc-90 86.69,53.28 86.3,53.67 arc90 85.92,53.67 85.67,53.41 arc90 85.67,53.04 86.06,52.65 arc-90 86.06,52.27 85.8,52.01 arc-90 85.42,52.01 85.03,52.41 arc90 84.66,52.41 84.4,52.15 arc90 84.4,51.77 84.79,51.38 arc-90 84.79,51 84.53,50.75 arc-90 84.16,50.75 83.77,51.14 arc90 83.39,51.14 83.13,50.88 arc90 83.13,50.5 83.52,50.11 arc-90 83.52,49.74 83.27,49.48 arc-90 82.89,49.48 82.5,49.87 arc90 82.12,49.87 81.87,49.62 arc90 81.87,49.24 82.26,48.85 arc-90 82.26,48.47 82,48.21 arc-90 81.62,48.21 81.23,48.6 arc90 80.86,48.6 80.6,48.35 arc90 80.6,47.97 80.99,47.58 arc-90 80.99,47.2 80.73,46.95 arc-90 80.36,46.95 79.97,47.34 arc90 79.59,47.34 79.33,47.08 arc90 79.33,46.7 79.72,46.31 arc-90 79.72,45.94 79.47,45.68 arc-90 79.09,45.68 78.7,46.07 arc90 78.32,46.07 78.07,45.81 arc90 78.07,45.44 78.46,45.05 arc-90 78.46,44.67 78.2,44.41 arc-90 77.82,44.41 77.43,44.8 arc90 77.06,44.8 76.8,44.55 arc90 76.8,44.17 77.19,43.78 arc-90 77.19,43.4 76.93,43.15 arc-90 76.56,43.15 76.17,43.54 arc90 75.79,43.54 75.53,43.28 arc90 75.53,42.9 75.54,42.9 arc-90 75.54,42.52 75.54,36.62 72.71,33.78 71.89,33.78 71.12,34.55 71.12,44.83 71.32,45.03 71.32,45.33 72.3,46.31 RIGHT.16
DQBUS_12
  Top 0.152: RIGHT.14 71.15,50.01 70.17,50.99 69.41,50.99 67.31,53.09 67.31,63.25 68.33,64.26 72.71,64.26 72.96,64.52 74.82,64.52 76.34,66.04 76.65,66.04 arc-90 76.92,65.77 76.92,65.65 arc90 77.18,65.38 77.22,65.38 arc90 77.48,65.65 77.48,66.43 arc-90 77.75,66.7 77.78,66.7 arc-90 78.05,66.43 78.05,65.65 arc90 78.31,65.38 78.34,65.38 arc90 78.61,65.65 78.61,66.43 arc-90 78.88,66.7 78.91,66.7 arc-90 79.18,66.43 79.18,65.65 arc90 79.44,65.38 79.47,65.38 arc90 79.74,65.65 79.74,66.43 arc-90 80.01,66.7 80.04,66.7 arc-90 80.31,66.43 80.31,65.65 arc90 80.57,65.38 80.6,65.38 arc90 80.87,65.65 80.87,66.43 arc-90 81.14,66.7 81.17,66.7 arc-90 81.43,66.43 81.43,65.65 arc90 81.7,65.38 81.73,65.38 arc90 82,65.65 82,66.43 arc-90 82.27,66.7 82.3,66.7 arc-90 82.56,66.43 82.56,65.65 arc90 82.83,65.38 82.86,65.38 arc90 83.13,65.65 83.13,66.43 arc-90 83.39,66.7 83.43,66.7 arc-90 83.69,66.43 83.69,65.65 arc90 83.96,65.38 83.99,65.38 arc90 84.26,65.65 84.26,66.43 arc-90 84.52,66.7 84.56,66.7 arc-90 84.82,66.43 84.82,65.65 arc90 85.09,65.38 85.12,65.38 arc90 85.39,65.65 85.39,66.43 arc-90 85.65,66.7 85.68,66.7 arc-90 85.95,66.43 85.95,65.65 arc90 86.22,65.38 86.25,65.38 arc90 86.52,65.65 86.52,66.43 arc-90 86.78,66.7 86.81,66.7 arc-90 87.08,66.43 87.08,65.65 arc90 87.35,65.38 87.38,65.38 arc90 87.64,65.65 87.64,66.43 arc-90 87.91,66.7 87.94,66.7 arc-90 88.21,66.43 88.21,65.65 arc90 88.48,65.38 88.51,65.38 arc90 88.77,65.65 88.77,66.43 arc-90 89.04,66.7 89.07,66.7 arc-90 89.34,66.43 89.34,65.65 arc90 89.61,65.38 89.64,65.38 arc90 89.9,65.65 89.9,65.77 arc-90 90.17,66.04 91.44,66.04 93.54,63.94 94.81,63.94 95.25,63.5 95.25,62.23 96.08,61.4 96.81,61.4 97.38,60.83 97.38,53.78 J2.12
DQBUS_13
  Top 0.152: J2.10 96.32,55.32 95.4,54.41 95.4,52.88 94.34,51.82 92.71,51.82 92.71,52.07 91.95,52.83 90.17,52.83 arc-90 89.9,53.1 89.9,53.73 arc90 89.64,53.99 89.61,53.99 arc90 89.35,53.73 89.35,51.94 arc-90 89.08,51.67 89.06,51.67 arc-90 88.79,51.94 88.79,53.73 arc90 88.53,53.99 88.5,53.99 arc90 88.24,53.73 88.24,51.94 arc-90 87.97,51.67 87.95,51.67 arc-90 87.68,51.94 87.68,53.73 arc90 87.41,53.99 87.39,53.99 arc90 87.12,53.73 87.12,51.94 arc-90 86.86,51.67 86.84,51.67 arc-90 86.57,51.94 86.57,53.73 arc90 86.3,53.99 86.28,53.99 arc90 86.01,53.73 86.01,51.94 arc-90 85.75,51.67 85.72,51.67 arc-90 85.46,51.94 85.46,53.73 arc90 85.19,53.99 85.17,53.99 arc90 84.9,53.73 84.9,51.94 arc-90 84.64,51.67 84.61,51.67 arc-90 84.35,51.94 84.35,53.73 arc90 84.08,53.99 84.06,53.99 arc90 83.79,53.73 83.79,51.94 arc-90 83.53,51.67 83.5,51.67 arc-90 83.24,51.94 83.24,53.73 arc90 82.97,53.99 82.95,53.99 arc90 82.68,53.73 82.68,51.94 arc-90 82.41,51.67 82.39,51.67 arc-90 82.12,51.94 82.12,53.73 arc90 81.86,53.99 81.83,53.99 arc90 81.57,53.73 81.57,51.94 arc-90 81.3,51.67 81.28,51.67 arc-90 81.01,51.94 81.01,53.73 arc90 80.75,53.99 80.72,53.99 arc90 80.46,53.73 80.46,51.94 arc-90 80.19,51.67 80.17,51.67 arc-90 79.9,51.94 79.9,53.73 arc90 79.64,53.99 79.61,53.99 arc90 79.35,53.73 79.35,51.94 arc-90 79.08,51.67 79.06,51.67 arc-90 78.79,51.94 78.79,53.73 arc90 78.52,53.99 78.5,53.99 arc90 78.23,53.73 78.23,51.94 arc-90 77.97,51.67 77.95,51.67 arc-90 77.68,51.94 77.68,53.73 arc90 77.41,53.99 77.39,53.99 arc90 77.12,53.73 77.12,51.94 arc-90 76.86,51.67 76.83,51.67 arc-90 76.57,51.94 76.57,53.73 arc90 76.3,53.99 76.28,53.99 arc90 76.01,53.73 76.01,51.94 arc-90 75.75,51.67 75.72,51.67 arc-90 75.46,51.94 75.46,53.73 arc90 75.19,53.99 75.17,53.99 arc90 74.9,53.73 74.9,53.1 arc-90 74.63,52.83 74.42,52.83 73.91,53.34 73.09,53.34 RIGHT.12
DQBUS_14
  Top 0.152: J2.8 96.32,57.76 95.4,56.84 95.4,55.47 94.18,54.25 92.71,54.25 91.9,55.07 91.9,57.96 91.44,58.42 arc90 91.17,58.15 91.17,57.67 arc-90 90.91,57.4 90.9,57.4 arc-90 90.63,57.67 90.63,59.17 arc90 90.37,59.44 90.36,59.44 arc90 90.09,59.17 90.09,57.67 arc-90 89.83,57.4 89.82,57.4 arc-90 89.55,57.67 89.55,59.17 arc90 89.28,59.44 89.28,59.44 arc90 89.01,59.17 89.01,57.67 arc-90 88.74,57.4 88.74,57.4 arc-90 88.47,57.67 88.47,59.17 arc90 88.2,59.44 88.2,59.44 arc90 87.93,59.17 87.93,57.67 arc-90 87.66,57.4 87.66,57.4 arc-90 87.39,57.67 87.39,59.17 arc90 87.12,59.44 87.11,59.44 arc90 86.85,59.17 86.85,57.67 arc-90 86.58,57.4 86.57,57.4 arc-90 86.31,57.67 86.31,59.17 arc90 86.04,59.44 86.03,59.44 arc90 85.77,59.17 85.77,57.67 arc-90 85.5,57.4 85.49,57.4 arc-90 85.23,57.67 85.23,59.17 arc90 84.96,59.44 84.95,59.44 arc90 84.69,59.17 84.69,57.67 arc-90 84.42,57.4 84.41,57.4 arc-90 84.14,57.67 84.14,59.17 arc90 83.88,59.44 83.87,59.44 arc90 83.6,59.17 83.6,57.67 arc-90 83.34,57.4 83.33,57.4 arc-90 83.06,57.67 83.06,59.17 arc90 82.8,59.44 82.79,59.44 arc90 82.52,59.17 82.52,57.67 arc-90 82.26,57.4 82.25,57.4 arc-90 81.98,57.67 81.98,59.17 arc90 81.72,59.44 81.71,59.44 arc90 81.44,59.17 81.44,57.67 arc-90 81.17,57.4 81.17,57.4 arc-90 80.9,57.67 80.9,59.17 arc90 80.63,59.44 80.63,59.44 arc90 80.36,59.17 80.36,57.67 arc-90 80.09,57.4 80.09,57.4 arc-90 79.82,57.67 79.82,59.17 arc90 79.55,59.44 79.55,59.44 arc90 79.28,59.17 79.28,57.67 arc-90 79.01,57.4 79,57.4 arc-90 78.74,57.67 78.74,59.17 arc90 78.47,59.44 78.46,59.44 arc90 78.2,59.17 78.2,57.67 arc-90 77.93,57.4 77.92,57.4 arc-90 77.66,57.67 77.66,59.17 arc90 77.39,59.44 77.38,59.44 arc90 77.12,59.17 77.12,57.67 arc-90 76.85,57.4 76.84,57.4 arc-90 76.58,57.67 76.58,59.17 arc90 76.31,59.44 76.3,59.44 arc90 76.03,59.17 76.03,57.67 arc-90 75.77,57.4 75.76,57.4 arc-90 75.49,57.67 75.49,58.15 arc90 75.23,58.42 74.93,58.42 74.01,57.5 74.01,56.8 RIGHT.10
DQBUS_15
  Top 0.152: J2.6 96.32,60.35 95.4,59.44 93.45,59.44 89.39,63.5 arc-90 89.12,63.77 89.12,64.42 arc90 88.86,64.68 88.85,64.68 arc90 88.58,64.42 88.58,62.58 arc-90 88.32,62.32 88.31,62.32 arc-90 88.05,62.58 88.05,64.42 arc90 87.78,64.68 87.78,64.68 arc90 87.51,64.42 87.51,62.58 arc-90 87.24,62.32 87.24,62.32 arc-90 86.97,62.58 86.97,64.42 arc90 86.7,64.68 86.7,64.68 arc90 86.43,64.42 86.43,62.58 arc-90 86.17,62.32 86.16,62.32 arc-90 85.9,62.58 85.9,64.42 arc90 85.63,64.68 85.62,64.68 arc90 85.36,64.42 85.36,62.58 arc-90 85.09,62.32 85.09,62.32 arc-90 84.82,62.58 84.82,64.42 arc90 84.55,64.68 84.55,64.68 arc90 84.28,64.42 84.28,62.58 arc-90 84.02,62.32 84.01,62.32 arc-90 83.75,62.58 83.75,64.42 arc90 83.48,64.68 83.47,64.68 arc90 83.21,64.42 83.21,62.58 arc-90 82.94,62.32 82.94,62.32 arc-90 82.67,62.58 82.67,64.42 arc90 82.4,64.68 82.4,64.68 arc90 82.13,64.42 82.13,62.58 arc-90 81.86,62.32 81.86,62.32 arc-90 81.59,62.58 81.59,64.42 arc90 81.33,64.68 81.32,64.68 arc90 81.06,64.42 81.06,62.58 arc-90 80.79,62.32 80.78,62.32 arc-90 80.52,62.58 80.52,64.42 arc90 80.25,64.68 80.25,64.68 arc90 79.98,64.42 79.98,62.58 arc-90 79.71,62.32 79.71,62.32 arc-90 79.44,62.58 79.44,64.42 arc90 79.17,64.68 79.17,64.68 arc90 78.9,64.42 78.9,62.58 arc-90 78.64,62.32 78.63,62.32 arc-90 78.37,62.58 78.37,64.42 arc90 78.1,64.68 78.09,64.68 arc90 77.83,64.42 77.83,62.58 arc-90 77.56,62.32 77.56,62.32 arc-90 77.29,62.58 77.29,64.42 arc90 77.02,64.68 77.02,64.68 arc90 76.75,64.42 76.75,62.58 arc-90 76.49,62.32 76.48,62.32 arc-90 76.22,62.58 76.22,64.42 arc90 75.95,64.68 75.94,64.68 arc90 75.68,64.42 75.68,63.77 arc-90 75.41,63.5 74.93,63.5 73.56,62.13 73.56,59.45 72.2,58.09 72.2,57.73 RIGHT.8
DQBUS_16
  Top 0.152: LEFT.38 30.94,19.81 29.87,19.81 28.92,20.76 28.06,20.76 27.62,20.32 26.67,20.32 arc90 26.4,20.05 26.4,19.43 arc-90 26.14,19.16 26.1,19.16 arc-90 25.83,19.43 25.83,21.21 arc90 25.57,21.48 25.53,21.48 arc90 25.27,21.21 25.27,19.43 arc-90 25,19.16 24.96,19.16 arc-90 24.7,19.43 24.7,21.21 arc90 24.43,21.48 24.39,21.48 arc90 24.13,21.21 24.13,19.43 arc-90 23.86,19.16 23.82,19.16 arc-90 23.56,19.43 23.56,21.21 arc90 23.29,21.48 23.25,21.48 arc90 22.99,21.21 22.99,19.43 arc-90 22.72,19.16 22.69,19.16 arc-90 22.42,19.43 22.42,21.21 arc90 22.15,21.48 22.12,21.48 arc90 21.85,21.21 21.85,19.43 arc-90 21.58,19.16 21.55,19.16 arc-90 21.28,19.43 21.28,21.21 arc90 21.01,21.48 20.98,21.48 arc90 20.71,21.21 20.71,19.43 arc-90 20.45,19.16 20.41,19.16 arc-90 20.14,19.43 20.14,21.21 arc90 19.88,21.48 19.84,21.48 arc90 19.57,21.21 19.57,19.43 arc-90 19.31,19.16 19.27,19.16 arc-90 19,19.43 19,21.21 arc90 18.74,21.48 18.7,21.48 arc90 18.43,21.21 18.43,19.43 arc-90 18.17,19.16 18.13,19.16 arc-90 17.87,19.43 17.87,21.21 arc90 17.6,21.48 17.56,21.48 arc90 17.3,21.21 17.3,19.43 arc-90 17.03,19.16 17,19.16 arc-90 16.73,19.43 16.73,21.21 arc90 16.46,21.48 16.43,21.48 arc90 16.16,21.21 16.16,19.43 arc-90 15.89,19.16 15.86,19.16 arc-90 15.59,19.43 15.59,21.21 arc90 15.32,21.48 15.29,21.48 arc90 15.02,21.21 15.02,19.43 arc-90 14.75,19.16 14.72,19.16 arc-90 14.45,19.43 14.45,21.21 arc90 14.19,21.48 14.15,21.48 arc90 13.88,21.21 13.88,19.43 arc-90 13.62,19.16 13.58,19.16 arc-90 13.31,19.43 13.31,21.21 arc90 13.05,21.48 13.01,21.48 arc90 12.74,21.21 12.74,19.43 arc-90 12.48,19.16 12.44,19.16 arc-90 12.18,19.43 12.18,20.05 arc90 11.91,20.32 11.43,20.32 8.84,22.91 8.84,27.89 6.86,29.87 J1.30
DQBUS_17